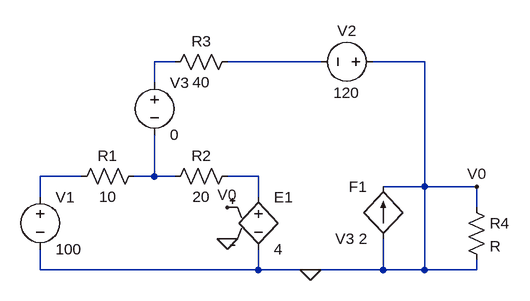
[diagram p0: schematic Draft32.asc]
Draft32.asc, the LTspice schematic file:
Version 4
SHEET 1 880 680
WIRE 240 -64 208 -64
WIRE 464 -64 320 -64
WIRE 624 -64 544 -64
WIRE 208 -32 208 -64
WIRE 96 112 32 112
WIRE 208 112 208 48
WIRE 208 112 176 112
WIRE 240 112 208 112
WIRE 368 112 320 112
WIRE 624 128 624 -64
WIRE 624 128 560 128
WIRE 704 128 624 128
WIRE 32 144 32 112
WIRE 368 144 368 112
WIRE 704 160 704 128
WIRE 32 256 32 224
WIRE 368 256 368 224
WIRE 368 256 32 256
WIRE 448 256 368 256
WIRE 560 256 560 208
WIRE 560 256 448 256
WIRE 624 256 624 128
WIRE 624 256 560 256
WIRE 704 256 704 240
WIRE 704 256 624 256
FLAG 448 256 0
FLAG 320 208 0
FLAG 704 128 V0
FLAG 320 160 V0
SYMBOL voltage 32 128 R0
SYMATTR InstName V1
SYMATTR Value 100
SYMBOL res 192 96 R90
WINDOW 0 0 56 VBottom 2
WINDOW 3 32 56 VTop 2
SYMATTR InstName R1
SYMATTR Value 10
SYMBOL res 336 96 R90
WINDOW 0 0 56 VBottom 2
WINDOW 3 32 56 VTop 2
SYMATTR InstName R2
SYMATTR Value 20
SYMBOL res 336 -80 R90
WINDOW 0 0 56 VBottom 2
WINDOW 3 32 56 VTop 2
SYMATTR InstName R3
SYMATTR Value 40
SYMBOL e 368 128 R0
SYMATTR InstName E1
SYMATTR Value 4
SYMBOL voltage 560 -64 R90
WINDOW 0 -32 56 VBottom 2
WINDOW 3 32 56 VTop 2
SYMATTR InstName V2
SYMATTR Value 120
SYMBOL voltage 208 -48 R0
SYMATTR InstName V3
SYMATTR Value 0
SYMBOL f 560 208 R180
WINDOW 0 24 80 Left 2
WINDOW 3 24 0 Left 2
SYMATTR InstName F1
SYMATTR Value V3 2
SYMBOL res 688 144 R0
SYMATTR InstName R4

The netlist it stands for:
* Draft32.asc
V1 N003 0 100
R1 N004 N003 10
R2 N005 N004 20
R3 N002 N001 40
E1 N005 0 0 0 4
V2 0 N002 120
V3 N001 N004 0
F1 0 0 V3 2
R4 0 0 R
.backanno
.end